# Altium schematic sheet analog-main.SchDoc
size A; SheetNumber: 1; SheetTotal: 2
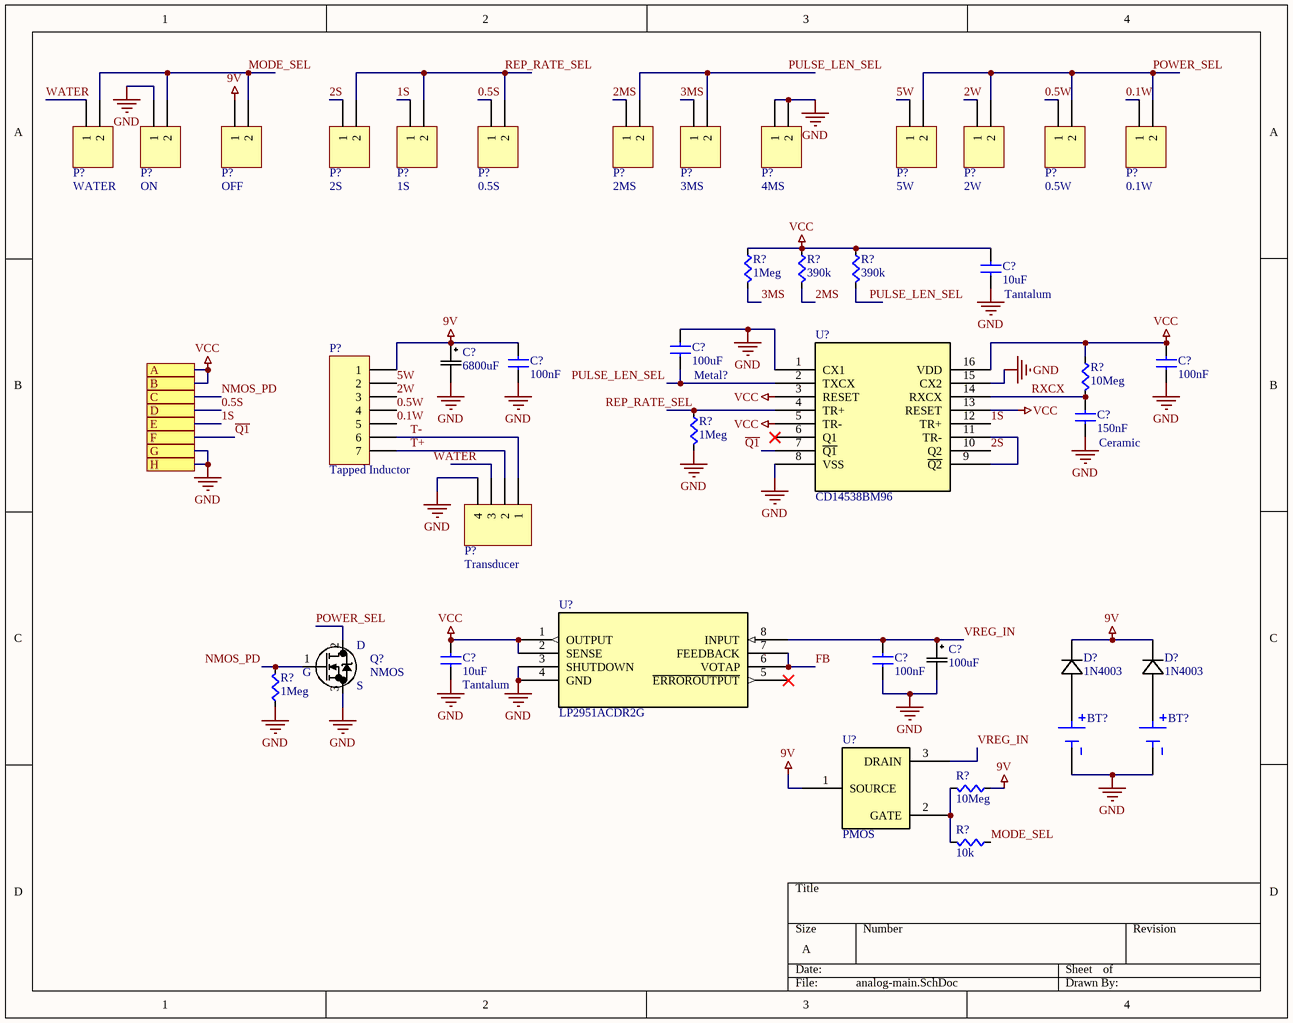
[diagram p0: analog-main.SchDoc]

## Parts
(Parts that share a designator on the sheet are numbered #1, #2 ... from top to bottom, then left to right.)
BT?#1  593_594  [BAT_593]  (value not drawn)
BT?#2  593_594  [BAT_593]  (value not drawn)
C?#1  Tantalum  value 10uF  [CAPC0603]
C?#2  6800uF  [CAP_TH_RADIAL_W18MM_D7.5MM]
C?#3  Metal?  value 100uF  [CAPC0603]
C?#4  value 100nF  [CAPC0603]  (hidden comment: Cap)
C?#5  value 100nF  [CAPC0603]  (hidden comment: Cap)
C?#6  Ceramic  value 150nF  [CAPC0603]
C?#7  100uF  [CAP_SMT_RADIAL_W6.6MM_D6.3MM]
C?#8  Tantalum  value 10uF  [CAPC0603]
C?#9  value 100nF  [CAPC0603]  (hidden comment: Cap)
D?#1  1N4003  [CR_1N4005_ONS]
D?#2  1N4003  [CR_1N4005_ONS]
P?#1  WATER  [HDR1X2]
P?#2  ON  [HDR1X2]
P?#3  OFF  [HDR1X2]
P?#4  2S  [HDR1X2]
P?#5  1S  [HDR1X2]
P?#6  0.5S  [HDR1X2]
P?#7  2MS  [HDR1X2]
P?#8  3MS  [HDR1X2]
P?#9  4MS  [HDR1X2]
P?#10  5W  [HDR1X2]
P?#11  2W  [HDR1X2]
P?#12  0.5W  [HDR1X2]
P?#13  0.1W  [HDR1X2]
P?#14  Tapped Inductor  [HDR1X7]
P?#15  Transducer  [HDR1X4]
Q?  NMOS  [TO-252AA]
R?#1  value 1Meg  [RES0603]  (hidden comment: Res)
R?#2  value 390k  [RES0603]  (hidden comment: Res)
R?#3  value 390k  [RES0603]  (hidden comment: Res)
R?#4  value 10Meg  [RES0603]  (hidden comment: Res)
R?#5  value 1Meg  [RES0603]  (hidden comment: Res)
R?#6  value 1Meg  [RES0603]  (hidden comment: Res)
R?#7  value 10Meg  [RES0603]  (hidden comment: Res)
R?#8  value 10k  [RES0603]  (hidden comment: Res)
U?#1  CD14538BM96  [SOIC16-3.9MM]
U?#2  LP2951ACDR2G  [SOIC8-3.9MM]
U?#3  PMOS  [TO-92]

## Ports
A, B, C, D, E, F, G, H

## Nets
9V: C?#2.1 C?#4.1(A) D?#1.1 D?#2.1 P?#3.1 P?#14.1 R?#7.2(B) U?#3.1(SOURCE)
GND: BT?#1.2(NEG) BT?#2.2(NEG) C?#1.2(B) C?#2.2 C?#3.1(A) C?#4.2(B) C?#5.2(B) C?#6.2(B) C?#7.2 C?#8.1(A) C?#9.2(B) P?#2.1 P?#9.1 P?#9.2 P?#15.4 Q?.3(S) R?#5.1(A) R?#6.2(B) U?#1.1(CX1) U?#1.8(VSS) U?#1.15(CX2) U?#2.3(SHUTDOWN) U?#2.4(GND) ; port G, port H
VCC: C?#1.1(A) C?#5.1(A) C?#8.2(B) R?#1.2(B) R?#2.2(B) R?#3.2(B) R?#4.2(B) U?#1.3(RESET) U?#1.5(TR-) U?#1.13(RESET) U?#1.16(VDD) U?#2.1(OUTPUT) U?#2.2(SENSE) ; port A, port B
0.1W: P?#13.1 P?#14.5
0.5S: P?#6.1 ; port D
0.5W: P?#12.1 P?#14.4
1S: P?#5.1 U?#1.12(TR+) ; port E
2MS: P?#7.1 R?#2.1(A)
2S: P?#4.1 U?#1.10(Q2)
2W: P?#11.1 P?#14.3
3MS: P?#8.1 R?#1.1(A)
5W: P?#10.1 P?#14.2
FB: U?#2.6(VOTAP) U?#2.7(FEEDBACK)
MODE_SEL: P?#1.2 P?#2.2 P?#3.2 R?#8.2(B)
NMOS_PD: Q?.1(G) R?#6.1(A) ; port C
POWER_SEL: P?#10.2 P?#11.2 P?#12.2 P?#13.2 Q?.2(D)
PULSE_LEN_SEL: C?#3.2(B) P?#7.2 P?#8.2 R?#3.1(A) U?#1.2(TXCX)
~{Q1}: U?#1.7(~{Q1}) ; port F
REP_RATE_SEL: P?#4.2 P?#5.2 P?#6.2 R?#5.2(B) U?#1.4(TR+)
RXCX: C?#6.1(A) R?#4.1(A) U?#1.14(RXCX)
T+: P?#14.7 P?#15.2
T-: P?#14.6 P?#15.1
VREG_IN: C?#7.1 C?#9.1(A) U?#2.8(INPUT) U?#3.3(DRAIN)
WATER: P?#1.1 P?#15.3
NetBT?#1_1: BT?#1.1(NEG) D?#1.2
NetBT?#2_1: BT?#2.1(NEG) D?#2.2
NetR?#7_1: R?#7.1(A) R?#8.1(A) U?#3.2(GATE)
NetU?#1_9: U?#1.9(~{Q2}) U?#1.11(TR-)

Not connected (* = marked no-connect by the designer): U?#1 6(Q1)*; U?#2 5(~{ERROROUTPUT})*

## Library data of the parts
BT?#1 BT?#2 = 593_594: Battery Contact Snap (Negative) 9V Cell PC Pin; MF: Keystone Electronics; MP: 593; Package: None; Price: None; Value: *; Availability: Unavailable
C?#1 C?#3 C?#6 C?#8 = Cap: Supplier 1: Digi-Key; Supplier Part Number 1: 1276-1000-1-ND
C?#2 = UKL1A682KHD: 6800 µF 10 V Aluminum Electrolytic Capacitors Radial, Can 2000 Hrs @ 85°C; Manufacturer_Name: Nichicon; Copyright: Copyright (C) 2026 Ultra Librarian. All rights reserved.; Manufacturer_Part_Number: UKL1A682KHD; Digi-Key_Part_Number_1: UKL1A682KHD-ND
C?#7 = EXV107M025A9HAA: 100 µF 25 V Aluminum Electrolytic Capacitors Radial, Can - SMD 340mOhm @ 100kHz 3000 Hrs @ 105°C; Manufacturer_Name: Kemet; Copyright: Copyright (C) 2026 Ultra Librarian. All rights reserved.; Manufacturer_Part_Number: EXV107M025A9HAA
D?#1 D?#2 = 1N4003: Diode 200 V 1A Through Hole DO-41; Manufacturer_Name: onsemi; Copyright: Copyright (C) 2025 Ultra Librarian. All rights reserved.; Manufacturer_Part_Number: 1N4003
P?#1-P?#13 = Header 2: Header, 2-Pin; LatestRevisionDate: 17-Jul-2002; LatestRevisionNote: Re-released for DXP Platform.; Publisher: Altium Limited
P?#14 = Header 7: Header, 7-Pin; LatestRevisionDate: 17-Jul-2002; LatestRevisionNote: Re-released for DXP Platform.; Publisher: Altium Limited
P?#15 = Header 4: Header, 4-Pin; LatestRevisionDate: 17-Jul-2002; LatestRevisionNote: Re-released for DXP Platform.; Publisher: Altium Limited
Q? = RFD14N05LSM: N-Channel 50 V 14A (Tc) 48W (Tc) Surface Mount TO-252AA; Manufacturer_Name: onsemi; Copyright: Copyright (C) 2025 Ultra Librarian. All rights reserved.; Manufacturer_Part_Number: RFD14N05LSM
R?#1-R?#8 = Res: SMD, RES0603; Supplier 1: Digi-Key; Supplier Part Number 1: RMCF0603JT10K0CT-ND
U?#1 = CD14538BM96: CMOS Dual Precision Monostable Multivibrator (125 C Operation) 16-SOIC -55 to 125; Manufacturer_Name: Texas Instruments; Copyright: Copyright (C) 2025 Ultra Librarian. All rights reserved.; Manufacturer_Part_Number: CD14538BM96; RefDes: RefDes; Type: Type
U?#2 = LP2951ACDR2G: Linear Voltage Regulator IC Positive Adjustable (Fixed) 1 Output 100mA 8-SOIC; Manufacturer_Name: onsemi; Copyright: Copyright (C) 2026 Ultra Librarian. All rights reserved.; Manufacturer_Part_Number: LP2951ACDR2G; RefDes: RefDes; Type: Type
U?#3 = VP0808L-G: P-Channel 80 V 280mA (Tj) 1W (Tc) Through Hole TO-92-3; Manufacturer_Name: Microchip; Copyright: Copyright (C) 2026 Ultra Librarian. All rights reserved.; Manufacturer_Part_Number: VP0808L-G; RefDes: RefDes; Type: Type
C?#4 C?#5 C?#9 = Cap: Supplier 1: Digi-Key; Supplier Part Number 1: 1276-1000-1-ND